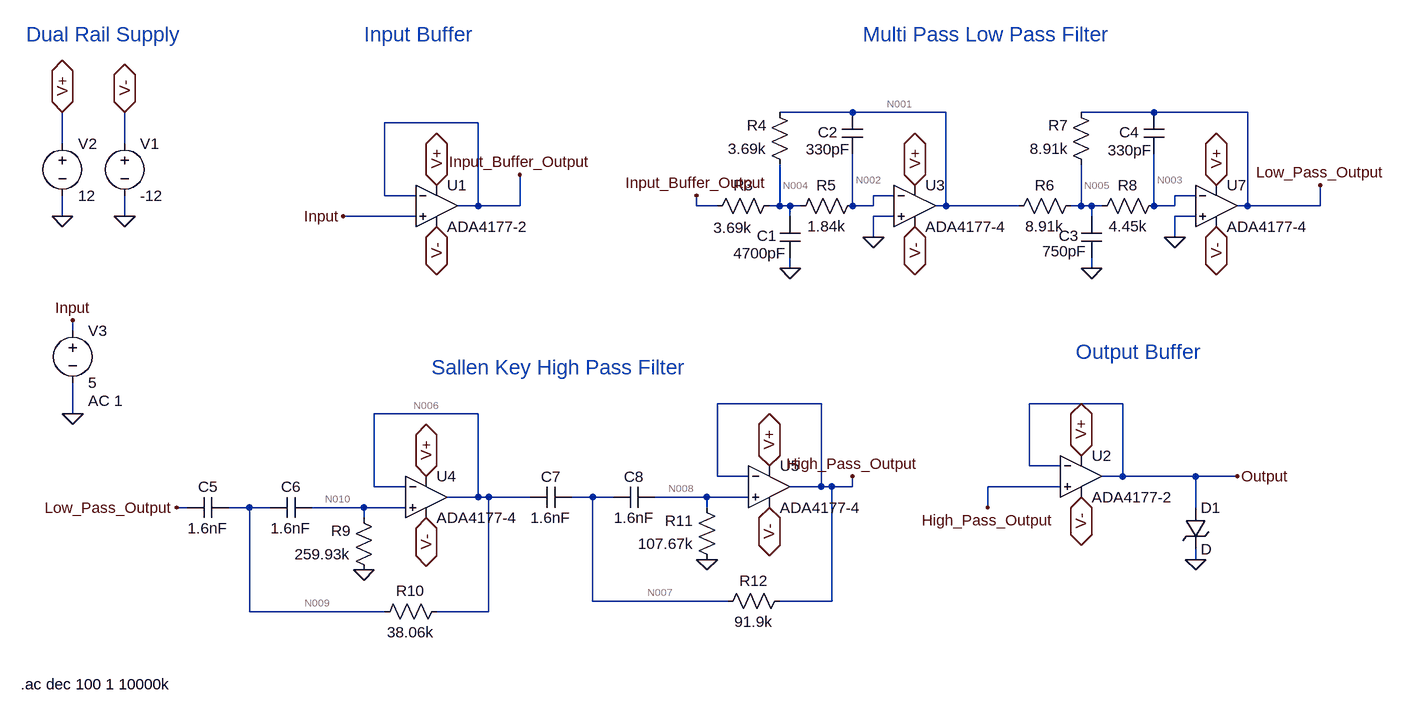
[diagram p0: schematic 8thOrderBandpassFilter.asc]
* 8thOrderBandpassFilter.asc
* U3: ADA4177-4 (symbol OpAmps\ADA4177-4 not available, pins judged from their places): In+=0 In-=N002 V+=V+ V-=V- OUT=N001
* U4: ADA4177-4 (symbol OpAmps\ADA4177-4 not available, pins judged from their places): In+=N010 In-=N006 V+=V+ V-=V- OUT=N006
* U1: ADA4177-2 (symbol OpAmps\ADA4177-2 not available, pins judged from their places): In+=Input In-=Input_Buffer_Output V+=V+ V-=V- OUT=Input_Buffer_Output
* U2: ADA4177-2 (symbol OpAmps\ADA4177-2 not available, pins judged from their places): In+=High_Pass_Output In-=Output V+=V+ V-=V- OUT=Output
V1 V- 0 -12
V2 V+ 0 12
R3 Input_Buffer_Output N004 3.69k
R4 N004 N001 3.69k
R5 N004 N002 1.84k tol=1 pwr=1/8
C1 0 N004 4700pF
C2 N001 N002 330pF
* U7: ADA4177-4 (symbol OpAmps\ADA4177-4 not available, pins judged from their places): In+=0 In-=N003 V+=V+ V-=V- OUT=Low_Pass_Output
R6 N001 N005 8.91k
R7 N005 Low_Pass_Output 8.91k
R8 N005 N003 4.45k tol=5 pwr=0.166
C3 0 N005 750pF
C4 Low_Pass_Output N003 330pF
R10 N009 N006 38.06k tol=0.1 pwr=1/10
R9 0 N010 259.93k tol=0.1 pwr=1/10
C5 N009 Low_Pass_Output 1.6nF
C6 N010 N009 1.6nF
* U5: ADA4177-4 (symbol OpAmps\ADA4177-4 not available, pins judged from their places): In+=N008 In-=High_Pass_Output V+=V+ V-=V- OUT=High_Pass_Output
R12 N007 High_Pass_Output 91.9k tol=1 pwr=1/10
R11 0 N008 107.67k tol=0.5 pwr=1/10
C7 N007 N006 1.6nF
C8 N008 N007 1.6nF
D1 Output 0 D
V3 Input 0 5 AC 1
.model D D
.lib standard.dio
* Multi Pass Low Pass Filter
* Input Buffer
* Dual Rail Supply
* Sallen Key High Pass Filter
* Output Buffer
.ac dec 100 1 10000k
.backanno
.end

* Results of the author's LTspice run, read from the files saved beside the schematic
* Operating Point, zero values left out:
*   V(high_pass_output) = 34.01 µV
*   V(input) = 5 V
*   V(input_buffer_output) = 5 V
*   V(low_pass_output) = 5 V
*   V(n001) = -5 V
*   V(n002) = 11.04 µV
*   V(n003) = -6.273 µV
*   V(n004) = 10.3 µV
*   V(n005) = -8.06 µV
*   V(n006) = 79.75 µV
*   V(n007) = 34.01 µV
*   V(n008) = 32.35 µV
*   V(n009) = 79.75 µV
*   V(n010) = 78.09 µV
*   V(output) = 35.67 µV
*   V(v+) = 12 V
*   V(v-) = -12 V
*   I(R11) = -300.4 pA
*   I(R3) = 1.355 mA
*   I(R4) = 1.355 mA
*   I(R5) = -397.2 pA
*   I(R6) = -561.2 µA
*   I(R7) = -561.2 µA
*   I(R8) = -401.6 pA
*   I(R9) = -300.4 pA
*   I(V1) = 3 mA
*   I(V2) = -3 mA
*   I(V3) = 260.2 pA
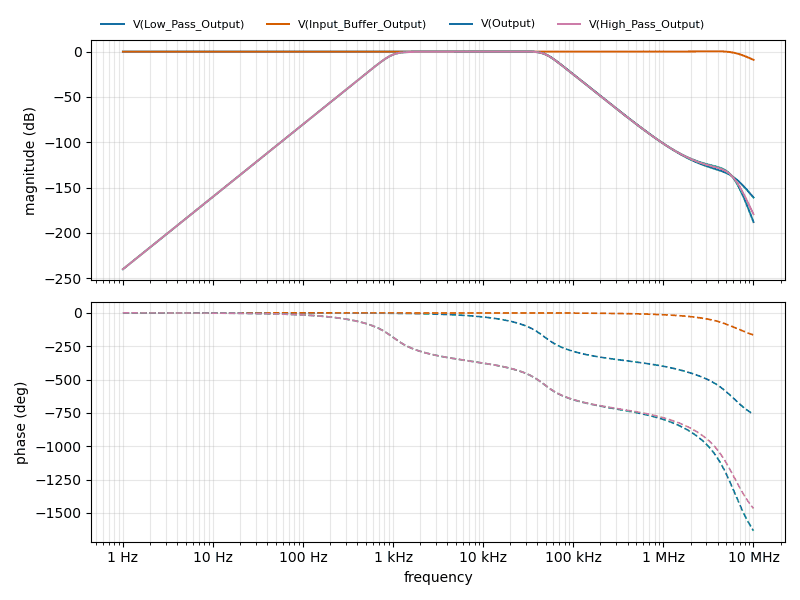
[diagram p1: AC Analysis of 8thOrderBandpassFilter.asc, plotted from the saved traces]
* AC Analysis, 1 run:
*   V(Low_Pass_Output): -0.00 dB at 1 Hz, -160.84 dB at 10 MHz, peak 0.20 dB at 28.84 kHz, 3 dB below the peak at 49.05 kHz
*   V(Input_Buffer_Output): -0.00 dB at 1 Hz, -8.99 dB at 10 MHz, peak 0.48 dB at 3.715 MHz, 3 dB below the peak at 6.867 MHz
*   V(Output): -240.00 dB at 1 Hz, -187.97 dB at 10 MHz, peak 0.02 dB at 28.84 kHz, 3 dB below the peak at 1.012 kHz and 49.05 kHz
*   V(High_Pass_Output): -240.00 dB at 1 Hz, -179.48 dB at 10 MHz, peak 0.02 dB at 28.84 kHz, 3 dB below the peak at 1.012 kHz and 49.05 kHz